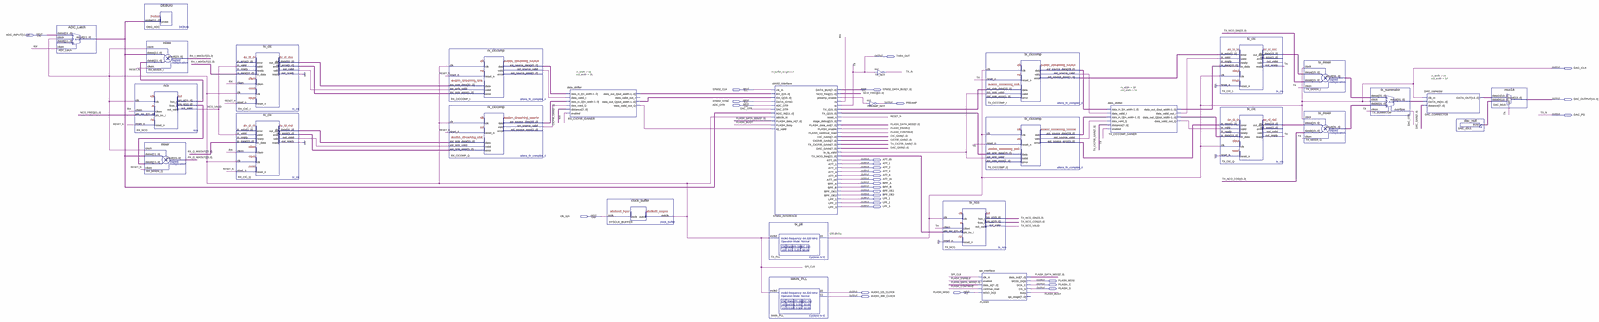
[diagram p0: schematic sheet, whole]
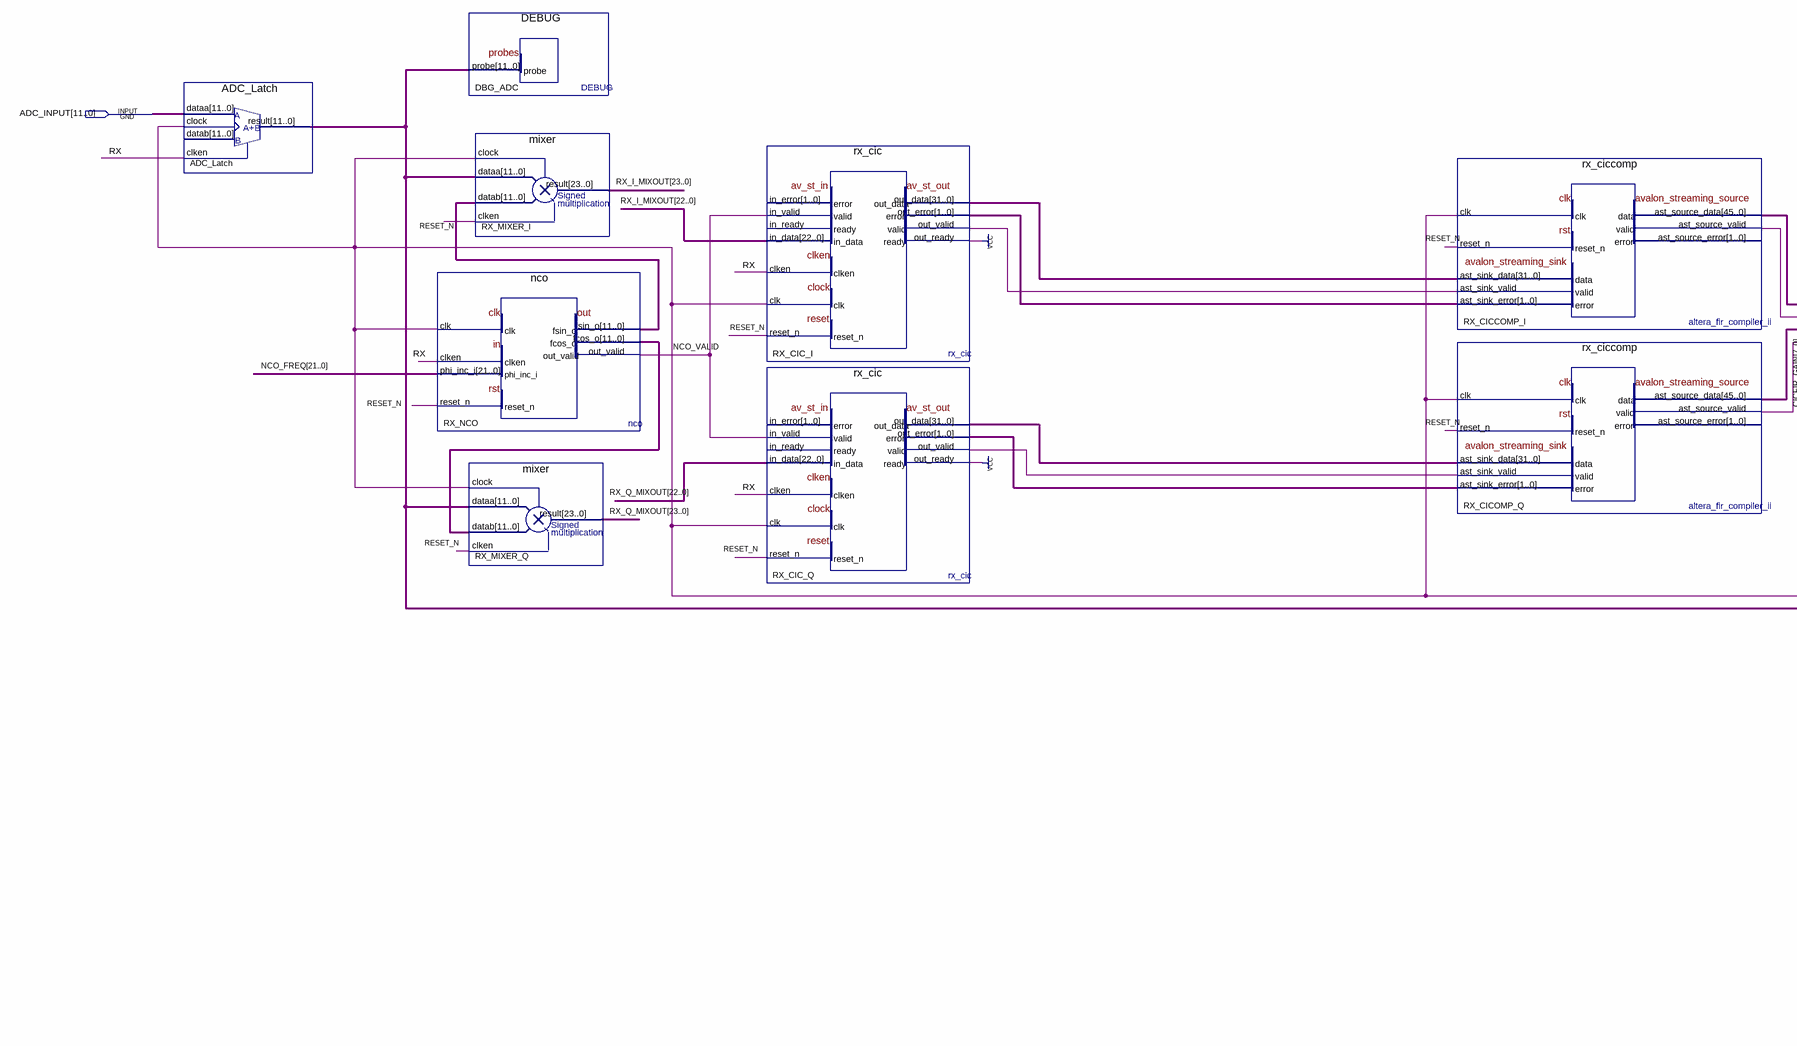
[diagram p1: schematic sheet, left part]
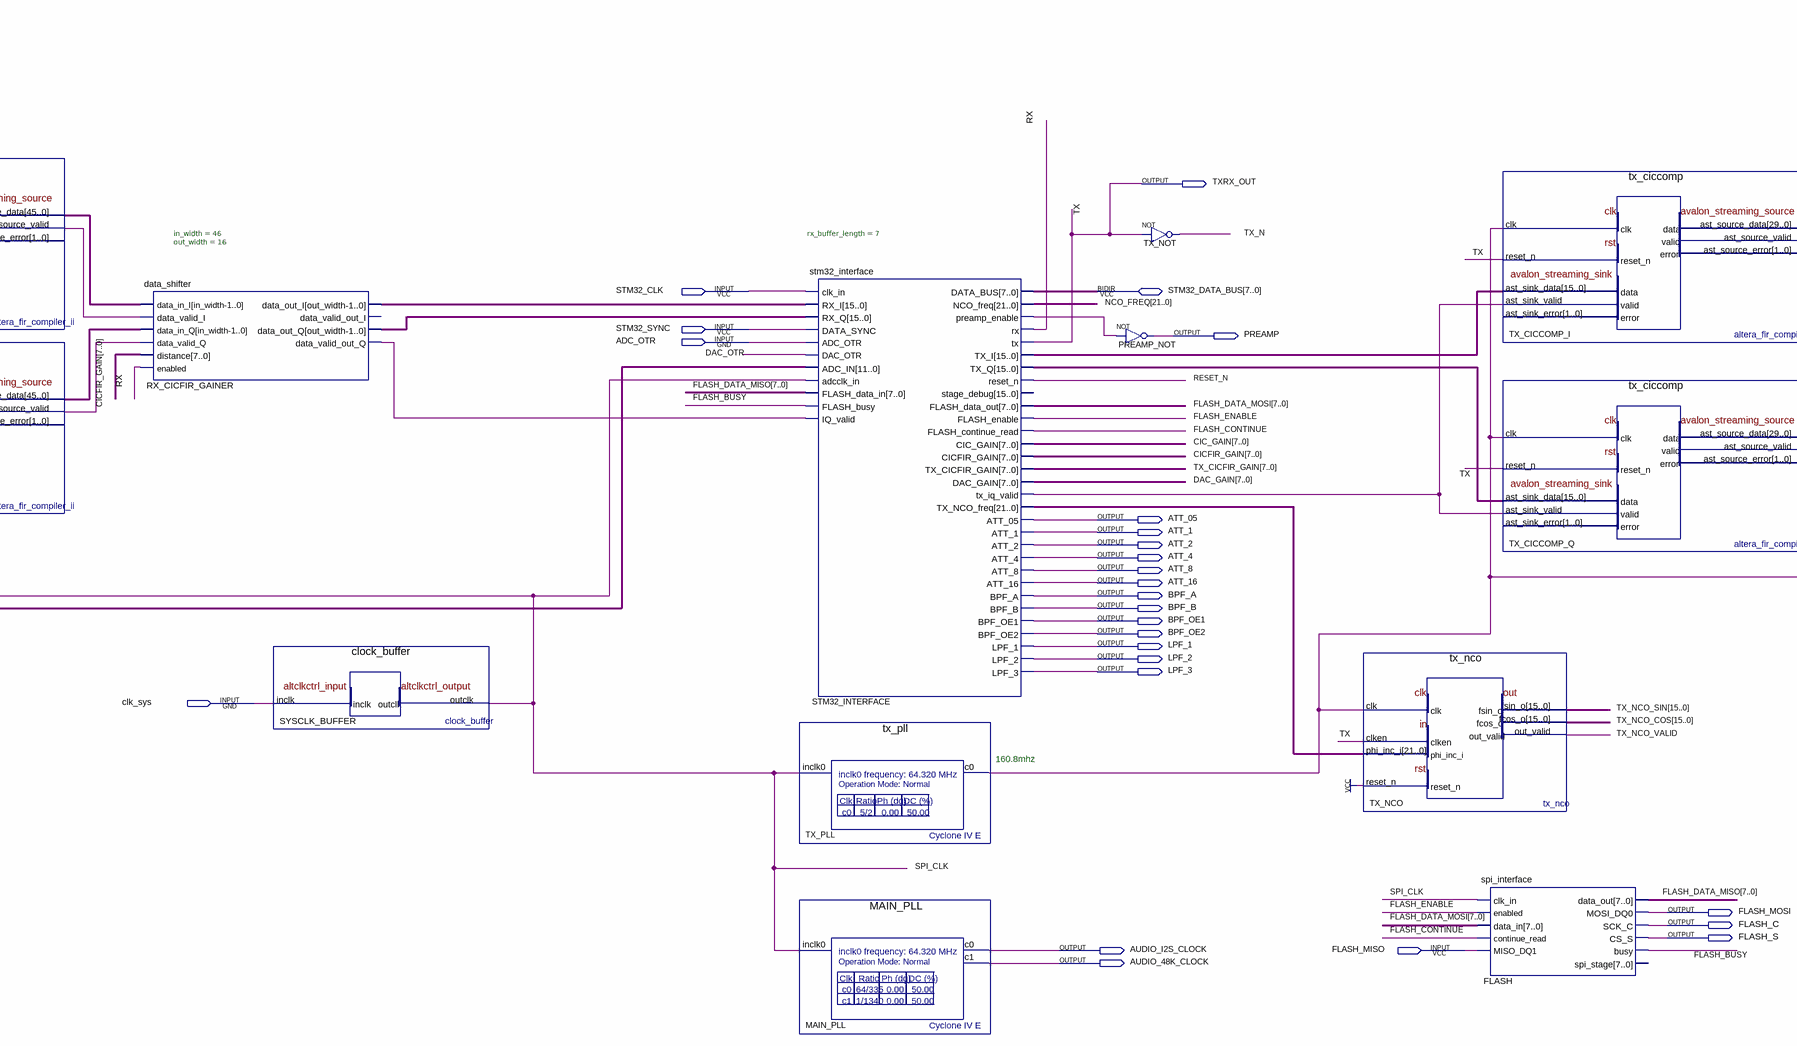
[diagram p2: schematic sheet, centre part]
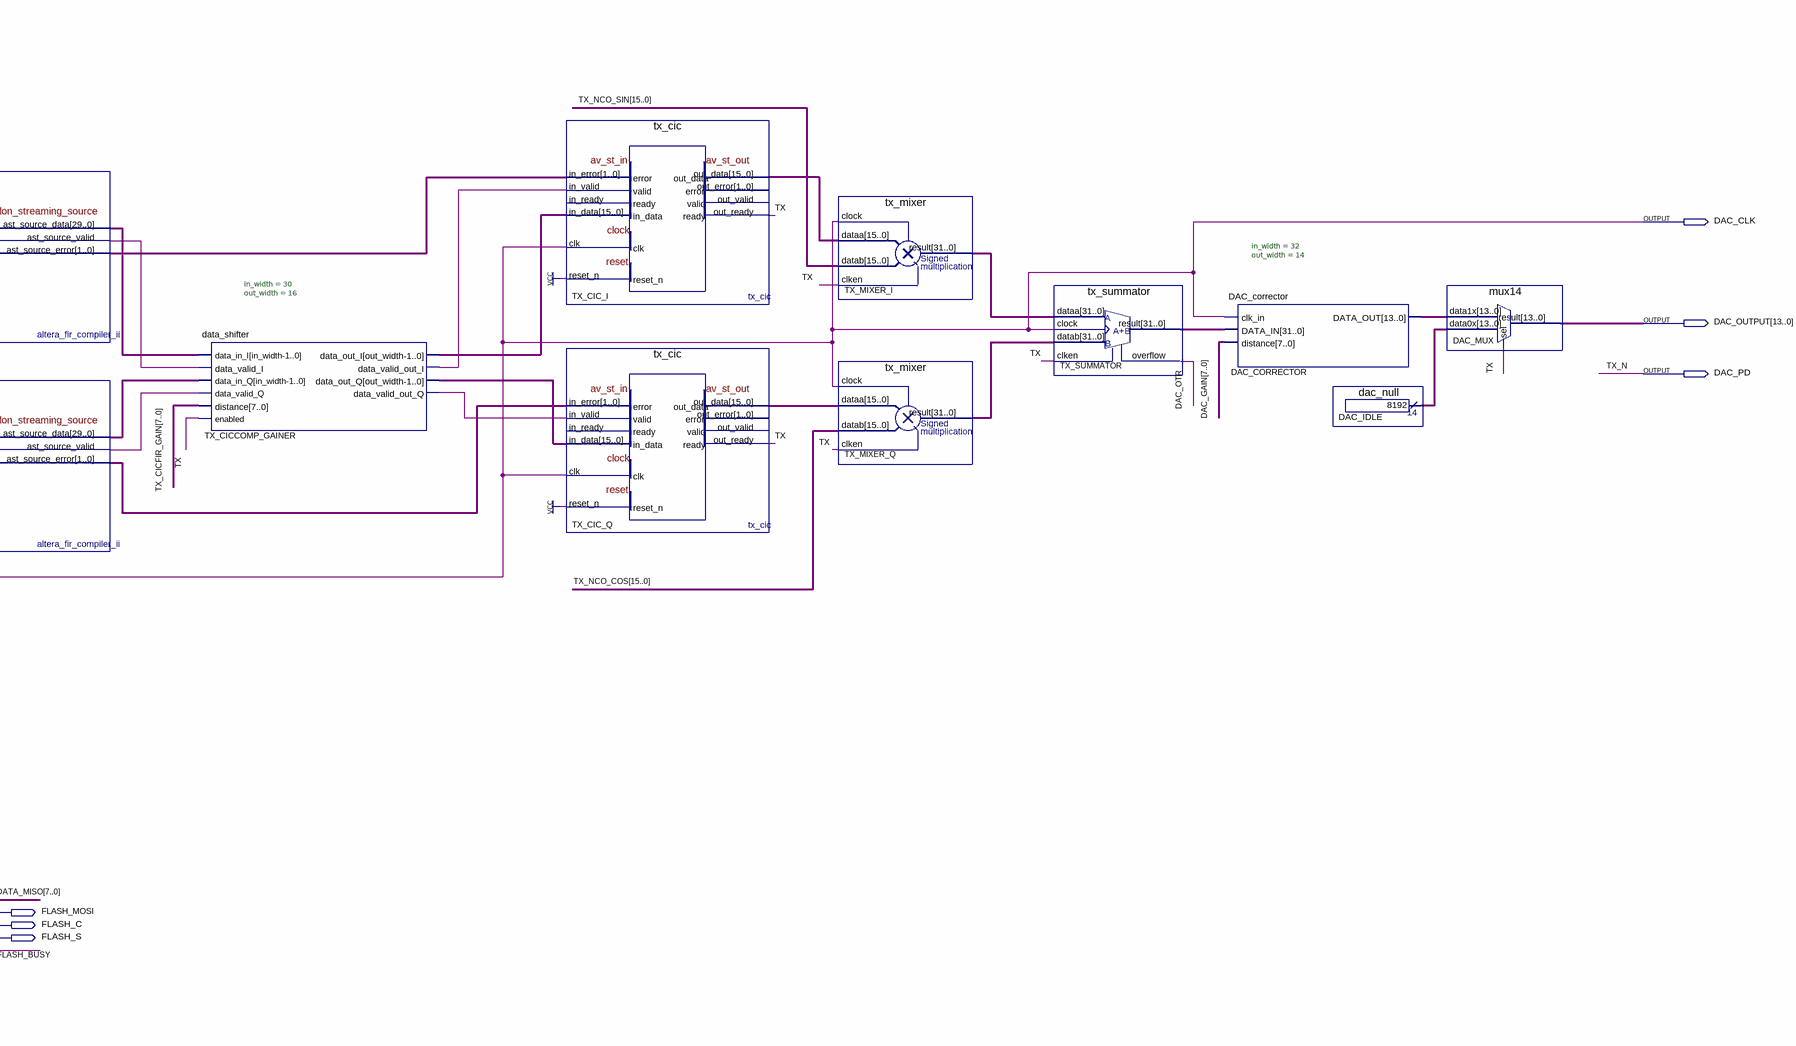
[diagram p3: schematic sheet, right part]
// Quartus schematic WOLF-LITE.bdf as structural Verilog: 29 symbols, 30 pins
module \WOLF-LITE  (
  input  [11:0] ADC_INPUT,
  input  STM32_CLK,
  input  STM32_SYNC,
  input  ADC_OTR,
  input  clk_sys,
  input  FLASH_MISO,
  inout  [7:0] STM32_DATA_BUS,
  output TXRX_OUT,
  output DAC_CLK,
  output [13:0] DAC_OUTPUT,
  output PREAMP,
  output DAC_PD,
  output ATT_05,
  output ATT_1,
  output ATT_2,
  output ATT_4,
  output ATT_8,
  output ATT_16,
  output BPF_A,
  output BPF_B,
  output BPF_OE1,
  output BPF_OE2,
  output LPF_1,
  output LPF_2,
  output LPF_3,
  output FLASH_MOSI,
  output FLASH_C,
  output FLASH_S,
  output AUDIO_I2S_CLOCK,
  output AUDIO_48K_CLOCK
);

  wire DAC_OTR, FLASH_BUSY, FLASH_CONTINUE, FLASH_ENABLE, NCO_VALID, RESET_N, RX, RX_CIC_I_out_valid,
       RX_CIC_Q_out_valid, RX_CICCOMP_I_ast_source_valid, RX_CICFIR_GAINER_data_valid_out_q,
       RX_CICOMP_Q_ast_source_valid, SPI_CLK, STM32_INTERFACE_preamp_enable, STM32_INTERFACE_tx_iq_valid,
       TX_CICCOMP_GAINER_data_valid_out_i, TX_CICCOMP_GAINER_data_valid_out_q, TX_CICCOMP_I_ast_source_valid,
       TX_CICCOMP_Q_ast_source_valid, TX_NCO_VALID;
  wire [1:0] RX_CIC_I_out_error, RX_CIC_Q_out_error, TX_CICCOMP_I_ast_source_error,
       TX_CICCOMP_Q_ast_source_error;
  wire [7:0] CIC_GAIN, CICFIR_GAIN, DAC_GAIN, FLASH_DATA_MISO, FLASH_DATA_MOSI, TX_CICFIR_GAIN;
  wire [11:0] ADC_Latch_result, RX_NCO_fcos_o, RX_NCO_fsin_o;
  wire [13:0] DAC_CORRECTOR_data_out, DAC_IDLE_result;
  wire [15:0] RX_CICFIR_GAINER_data_out_i, RX_CICFIR_GAINER_data_out_q, STM32_INTERFACE_tx_i,
       STM32_INTERFACE_tx_q, TX_CIC_I_out_data, TX_CIC_Q_out_data, TX_CICCOMP_GAINER_data_out_i,
       TX_CICCOMP_GAINER_data_out_q, TX_NCO_COS, TX_NCO_SIN;
  wire [21:0] NCO_FREQ, STM32_INTERFACE_tx_nco_freq;
  wire [23:0] RX_I_MIXOUT, RX_Q_MIXOUT;
  wire [29:0] TX_CICCOMP_I_ast_source_data, TX_CICCOMP_Q_ast_source_data;
  wire [31:0] RX_CIC_I_out_data, RX_CIC_Q_out_data, TX_MIXER_I_result, TX_MIXER_Q_result, TX_SUMMATOR_result;
  wire [45:0] RX_CICCOMP_I_ast_source_data, RX_CICOMP_Q_ast_source_data;

  ADC_Latch ADC_Latch (.dataa(ADC_INPUT), .clken(RX), .clock(SPI_CLK), .result(ADC_Latch_result));  // open: datab
  nco RX_NCO (
    .clk(SPI_CLK), .clken(RX), .phi_inc_i(NCO_FREQ), .reset_n(RESET_N), .fsin_o(RX_NCO_fsin_o),
    .fcos_o(RX_NCO_fcos_o), .out_valid(NCO_VALID));
  DEBUG DBG_ADC (.probe(ADC_Latch_result));
  mixer RX_MIXER_I (
    .clock(SPI_CLK), .dataa(ADC_Latch_result), .datab(RX_NCO_fsin_o), .clken(RESET_N), .result(RX_I_MIXOUT));
  mixer RX_MIXER_Q (
    .clock(SPI_CLK), .dataa(ADC_Latch_result), .datab(RX_NCO_fcos_o), .clken(RESET_N), .result(RX_Q_MIXOUT));
  rx_cic RX_CIC_I (
    .in_valid(NCO_VALID), .in_data(RX_I_MIXOUT[22:0]), .out_ready(1'b1), .clken(RX), .clk(SPI_CLK),
    .reset_n(RESET_N), .out_data(RX_CIC_I_out_data), .out_error(RX_CIC_I_out_error),
    .out_valid(RX_CIC_I_out_valid));  // open: in_error, in_ready
  rx_cic RX_CIC_Q (
    .in_valid(NCO_VALID), .in_data(RX_Q_MIXOUT[22:0]), .out_ready(1'b1), .clken(RX), .clk(SPI_CLK),
    .reset_n(RESET_N), .out_data(RX_CIC_Q_out_data), .out_error(RX_CIC_Q_out_error),
    .out_valid(RX_CIC_Q_out_valid));  // open: in_error, in_ready
  rx_ciccomp RX_CICCOMP_I (
    .clk(SPI_CLK), .reset_n(RESET_N), .ast_sink_data(RX_CIC_I_out_data), .ast_sink_valid(RX_CIC_I_out_valid),
    .ast_sink_error(RX_CIC_I_out_error), .ast_source_data(RX_CICCOMP_I_ast_source_data),
    .ast_source_valid(RX_CICCOMP_I_ast_source_valid));  // open: ast_source_error
  rx_ciccomp RX_CICOMP_Q (
    .clk(SPI_CLK), .reset_n(RESET_N), .ast_sink_data(RX_CIC_Q_out_data), .ast_sink_valid(RX_CIC_Q_out_valid),
    .ast_sink_error(RX_CIC_Q_out_error), .ast_source_data(RX_CICOMP_Q_ast_source_data),
    .ast_source_valid(RX_CICOMP_Q_ast_source_valid));  // open: ast_source_error
  data_shifter #(.in_width(46), .out_width(16)) RX_CICFIR_GAINER (
    .data_in_I(RX_CICCOMP_I_ast_source_data), .data_valid_I(RX_CICCOMP_I_ast_source_valid),
    .data_in_Q(RX_CICOMP_Q_ast_source_data), .data_valid_Q(RX_CICOMP_Q_ast_source_valid),
    .distance(CICFIR_GAIN), .enabled(RX), .data_out_I(RX_CICFIR_GAINER_data_out_i),
    .data_out_Q(RX_CICFIR_GAINER_data_out_q), .data_valid_out_Q(RX_CICFIR_GAINER_data_valid_out_q));  // open: data_valid_out_I
  clock_buffer SYSCLK_BUFFER (.inclk(clk_sys), .outclk(SPI_CLK));
  stm32_interface #(.rx_buffer_length(7)) STM32_INTERFACE (
    .clk_in(STM32_CLK), .RX_I(RX_CICFIR_GAINER_data_out_i), .RX_Q(RX_CICFIR_GAINER_data_out_q),
    .DATA_SYNC(STM32_SYNC), .ADC_OTR(ADC_OTR), .DAC_OTR(DAC_OTR), .ADC_IN(ADC_Latch_result),
    .adcclk_in(SPI_CLK), .FLASH_data_in(FLASH_DATA_MISO), .FLASH_busy(FLASH_BUSY),
    .IQ_valid(RX_CICFIR_GAINER_data_valid_out_q), .NCO_freq(NCO_FREQ),
    .preamp_enable(STM32_INTERFACE_preamp_enable), .rx(RX), .tx(TXRX_OUT), .TX_I(STM32_INTERFACE_tx_i),
    .TX_Q(STM32_INTERFACE_tx_q), .reset_n(RESET_N), .FLASH_data_out(FLASH_DATA_MOSI),
    .FLASH_enable(FLASH_ENABLE), .FLASH_continue_read(FLASH_CONTINUE), .CIC_GAIN(CIC_GAIN),
    .CICFIR_GAIN(CICFIR_GAIN), .TX_CICFIR_GAIN(TX_CICFIR_GAIN), .DAC_GAIN(DAC_GAIN),
    .tx_iq_valid(STM32_INTERFACE_tx_iq_valid), .TX_NCO_freq(STM32_INTERFACE_tx_nco_freq), .ATT_05(ATT_05),
    .ATT_1(ATT_1), .ATT_2(ATT_2), .ATT_4(ATT_4), .ATT_8(ATT_8), .ATT_16(ATT_16), .BPF_A(BPF_A),
    .BPF_B(BPF_B), .BPF_OE1(BPF_OE1), .BPF_OE2(BPF_OE2), .LPF_1(LPF_1), .LPF_2(LPF_2), .LPF_3(LPF_3),
    .DATA_BUS(STM32_DATA_BUS));  // open: stage_debug
  tx_pll TX_PLL (.inclk0(SPI_CLK), .c0(DAC_CLK));
  MAIN_PLL MAIN_PLL (.inclk0(SPI_CLK), .c0(AUDIO_I2S_CLOCK), .c1(AUDIO_48K_CLOCK));
  not TX_NOT (DAC_PD, TXRX_OUT);
  not PREAMP_NOT (PREAMP, STM32_INTERFACE_preamp_enable);
  tx_nco TX_NCO (
    .clk(DAC_CLK), .clken(TXRX_OUT), .phi_inc_i(STM32_INTERFACE_tx_nco_freq), .reset_n(1'b1),
    .fsin_o(TX_NCO_SIN), .fcos_o(TX_NCO_COS), .out_valid(TX_NCO_VALID));
  spi_interface FLASH (
    .clk_in(SPI_CLK), .enabled(FLASH_ENABLE), .data_in(FLASH_DATA_MOSI), .continue_read(FLASH_CONTINUE),
    .MISO_DQ1(FLASH_MISO), .data_out(FLASH_DATA_MISO), .MOSI_DQ0(FLASH_MOSI), .SCK_C(FLASH_C),
    .CS_S(FLASH_S), .busy(FLASH_BUSY));  // open: spi_stage
  tx_ciccomp TX_CICCOMP_I (
    .clk(DAC_CLK), .reset_n(TXRX_OUT), .ast_sink_data(STM32_INTERFACE_tx_i),
    .ast_sink_valid(STM32_INTERFACE_tx_iq_valid), .ast_source_data(TX_CICCOMP_I_ast_source_data),
    .ast_source_valid(TX_CICCOMP_I_ast_source_valid), .ast_source_error(TX_CICCOMP_I_ast_source_error));  // open: ast_sink_error
  tx_ciccomp TX_CICCOMP_Q (
    .clk(DAC_CLK), .reset_n(TXRX_OUT), .ast_sink_data(STM32_INTERFACE_tx_q),
    .ast_sink_valid(STM32_INTERFACE_tx_iq_valid), .ast_source_data(TX_CICCOMP_Q_ast_source_data),
    .ast_source_valid(TX_CICCOMP_Q_ast_source_valid), .ast_source_error(TX_CICCOMP_Q_ast_source_error));  // open: ast_sink_error
  data_shifter #(.in_width(30), .out_width(16)) TX_CICCOMP_GAINER (
    .data_in_I(TX_CICCOMP_I_ast_source_data), .data_valid_I(TX_CICCOMP_I_ast_source_valid),
    .data_in_Q(TX_CICCOMP_Q_ast_source_data), .data_valid_Q(TX_CICCOMP_Q_ast_source_valid),
    .distance(TX_CICFIR_GAIN), .enabled(TXRX_OUT), .data_out_I(TX_CICCOMP_GAINER_data_out_i),
    .data_valid_out_I(TX_CICCOMP_GAINER_data_valid_out_i), .data_out_Q(TX_CICCOMP_GAINER_data_out_q),
    .data_valid_out_Q(TX_CICCOMP_GAINER_data_valid_out_q));
  tx_cic TX_CIC_I (
    .in_error(TX_CICCOMP_I_ast_source_error), .in_valid(TX_CICCOMP_GAINER_data_valid_out_i),
    .in_data(TX_CICCOMP_GAINER_data_out_i), .out_ready(TXRX_OUT), .clk(DAC_CLK), .reset_n(1'b1),
    .out_data(TX_CIC_I_out_data));  // open: in_ready, out_error, out_valid
  tx_cic TX_CIC_Q (
    .in_error(TX_CICCOMP_Q_ast_source_error), .in_valid(TX_CICCOMP_GAINER_data_valid_out_q),
    .in_data(TX_CICCOMP_GAINER_data_out_q), .out_ready(TXRX_OUT), .clk(DAC_CLK), .reset_n(1'b1),
    .out_data(TX_CIC_Q_out_data));  // open: in_ready, out_error, out_valid
  tx_mixer TX_MIXER_I (
    .clock(DAC_CLK), .dataa(TX_CIC_I_out_data), .datab(TX_NCO_SIN), .clken(TXRX_OUT),
    .result(TX_MIXER_I_result));
  tx_mixer TX_MIXER_Q (
    .clock(DAC_CLK), .dataa(TX_CIC_Q_out_data), .datab(TX_NCO_COS), .clken(TXRX_OUT),
    .result(TX_MIXER_Q_result));
  tx_summator TX_SUMMATOR (
    .dataa(TX_MIXER_I_result), .datab(TX_MIXER_Q_result), .clken(TXRX_OUT), .clock(DAC_CLK),
    .result(TX_SUMMATOR_result), .overflow(DAC_OTR));
  DAC_corrector #(.in_width(32), .out_width(14)) DAC_CORRECTOR (
    .clk_in(DAC_CLK), .DATA_IN(TX_SUMMATOR_result), .distance(DAC_GAIN), .DATA_OUT(DAC_CORRECTOR_data_out));
  dac_null DAC_IDLE (.result(DAC_IDLE_result));
  mux14 DAC_MUX (.data1x(DAC_CORRECTOR_data_out), .data0x(DAC_IDLE_result), .sel(TXRX_OUT), .result(DAC_OUTPUT));

  // Other names for the same wires on the sheet: TX_N = DAC_PD; TX = TXRX_OUT

  // Notes on the sheet:
  //   160.8mhz
endmodule
